# Altium schematic sheet MotorController.SchDoc
size A
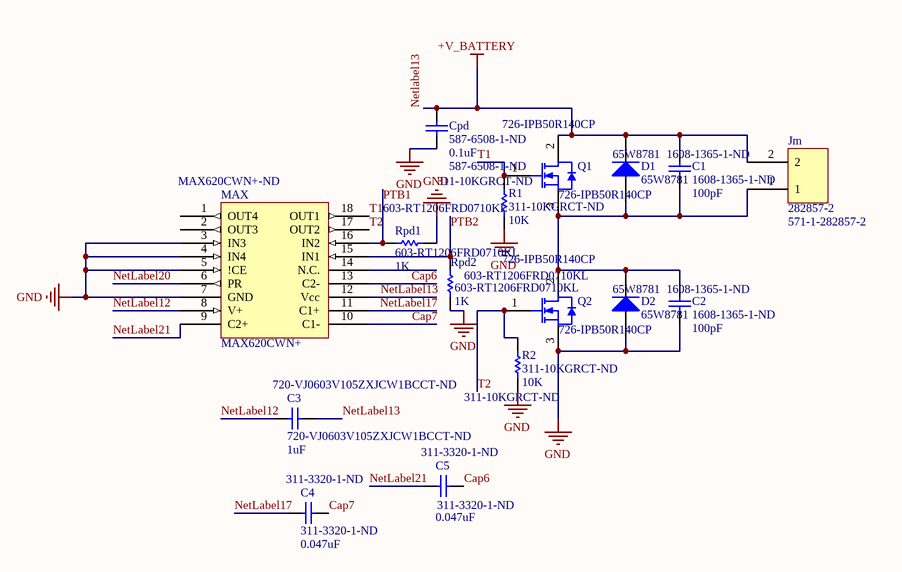
[diagram p0: MotorController.SchDoc]

## Parts
C1  1608-1365-1-ND  value 100pF  [1608[0603]]
C2  1608-1365-1-ND  value 100pF  [1608[0603]]
C3  720-VJ0603V105ZXJCW1BCCT-ND  value 1uF  [C1206]
C4  311-3320-1-ND  value 0.047uF  [C1206]
C5  311-3320-1-ND  value 0.047uF  [C1206]
Cpd  587-6508-1-ND  value 0.1uF  [C1206]
D1  65W8781  [SMC]
D2  65W8781  [SMC]
Jm  282857-2  Supplier Part Number 1: 571-1-282857-2  [282857-2]
MAX  MAX620CWN+  Supplier Part Number 2: MAX620CWN+-ND  [SOIC-SO18_L]
Q1  726-IPB50R140CP  [INF-PG-TO263-3-2_N]
Q2  726-IPB50R140CP  [INF-PG-TO263-3-2_N]
R1  311-10KGRCT-ND  value 10K  [C1206]
R2  311-10KGRCT-ND  value 10K  [C1206]
Rpd1  603-RT1206FRD0710KL  value 1K  [C1206]
Rpd2  603-RT1206FRD0710KL  value 1K  [C1206]

## Nets
GND: C2.1 Cpd.1 D2.1(A) MAX.3(IN3) MAX.4(IN4) MAX.5(!CE) MAX.7(GND) Q2.3(SOURCE) R1.1 R2.1 Rpd1.2 Rpd2.1
NetLabel13: C1.2 C3.2 Cpd.2 D1.2(K) Jm.2 MAX.12(Vcc) Q1.2(DRAIN)  [also labelled +V_BATTERY]
Cap6: C5.1 MAX.13(C2-)
Cap7: C4.2 MAX.10(C1-)
NetLabel12: C3.1 MAX.8(V+)
NetLabel17: C4.1 MAX.11(C1+)
NetLabel20: MAX.6(PR)
NetLabel21: C5.2 MAX.9(C2+)
PTB1: MAX.16(IN2) Rpd1.1
PTB2: MAX.15(IN1) Rpd2.2
T1: MAX.18(OUT1) Q1.1(GATE) R1.2
T2: MAX.17(OUT2) Q2.1(GATE) R2.2
NetC1_1: C1.1 C2.2 D1.1(A) D2.2(K) Jm.1 Q1.3(SOURCE) Q2.2(DRAIN)

Not connected (* = marked no-connect by the designer): MAX 1(OUT4) 2(OUT3) 14(N.C.)

## Library data of the parts
C1 C2 = Cap: Multilayer Ceramic Capacitors MLCC - SMD/SMT 0603 100pF 50V 5% Tol C0G, Digi-key; Manufacturer: Knowles Syfer; Manufacturer Part Number: 0603Y0500101JCT; Dissipation Factor: 0.1%; Capacitance: 50pF; Published: 8-Jun-2000; LatestRevisionDate: 17-Jul-2002; LatestRevisionNote: Re-released for DXP Platform.; PackageReference: RAD-0.3; Publisher: Altium Limited; PackageDescription: Radial Cap, Thru-Hole; 2 Leads; 0.3 in Pin Spacing; Supplier 1: Digi-Key; Supplier 2: Digi-Key; Supplier Part Number 2: 1608-1365-1-ND; RoHS: Yes; Category: Ceramic Capacitors; Stock 2: 32028; Pricing 2: 1=0.59000, 10=0.42000, 100=0.27650, 500=0.20480, 1000=0.17407 (USD); Case/Package: 0603; Case Code (Imperial): 0603; Case Code (Metric): 1608; Min Operating Temperature: -55°C; Max Operating Temperature: 125°C; Termination: SMD/SMT; Composition: Ceramic; Dielectric: C0G; Tolerance: 5%; Packaging: Tape and Reel; Package Quantity: 4000; Voltage Rating: 50V; Voltage Rating (DC): 50V; Length: 1.6mm; Depth: 0.8mm; ComponentLink1URL: https://datasheet.ciiva.com/5428/tandardmlccdatasheet-369797-5428107.pdf?src-supplier=Mouser; ComponentLink1Description: https://datasheet.ciiva.com/5428/tandardmlccdatasheet-369797-5428107.pdf?src-supplier=Mouser
C3 = Cap: Cap Ceramic 1uF 16V Y5V -20% to 80% SMD 0603 85C Paper T/R, Digi-key; Manufacturer: Vishay Vitramon; Dielectric Material: Tantalum; Published: 8-Jun-2000; LatestRevisionDate: 17-Jul-2002; LatestRevisionNote: Re-released for DXP Platform.; PackageReference: RAD-0.3; Publisher: Altium Limited; PackageDescription: Radial Cap, Thru-Hole; 2 Leads; 0.3 in Pin Spacing; Supplier 1: Digi-Key; Supplier Part Number 1: 720-VJ0603V105ZXJCW1BCCT-ND; Manufacturer Part Number: VJ0603V105ZXJCW1BC; RoHS: Yes; Category: Ceramic Capacitors; Stock 1: 4000; Pricing 1: 1=0.29000, 10=0.19600, 100=0.09910, 500=0.06784, 1000=0.06001 (USD); Mount: Surface Mount; Case/Package: 0603; Min Operating Temperature: -25°C; Max Operating Temperature: 85°C; Capacitance: 1uF; Tolerance: 80%; Dielectric: Y5V; Voltage Rating (DC): 16V; Length: 1.6mm; Depth: 0.8mm; Lead Free: Lead Free; ComponentLink1URL: https://datasheet.ciiva.com/11489/vjw1bcbascomseries-11489855.pdf?src-supplier=Avnet; ComponentLink1Description: https://datasheet.ciiva.com/11489/vjw1bcbascomseries-11489855.pdf?src-supplier=Avnet
C4 C5 = Cap: CAP CER 0.47UF 4V X5R 0201, Digi-key; Manufacturer: Yageo; Manufacturer Part Number: CC0201MRX5R4BB474; Capacitance: 470nF; Tolerance: 20%; Published: 8-Jun-2000; LatestRevisionDate: 17-Jul-2002; LatestRevisionNote: Re-released for DXP Platform.; PackageReference: RAD-0.3; Publisher: Altium Limited; PackageDescription: Radial Cap, Thru-Hole; 2 Leads; 0.3 in Pin Spacing; Supplier 1: Digi-Key; Supplier Part Number 1: 311-3320-1-ND; RoHS: Yes; Category: Ceramic Capacitors; Stock 1: 31395; Pricing 1: 1=0.10000, 10=0.07100, 100=0.03150, 500=0.02252, 1000=0.01770, 2500=0.01609, 5000=0.01480 (USD); Mount: Surface Mount; Case/Package: 0201; Min Operating Temperature: -55°C; Max Operating Temperature: 85°C; Packaging: Tape and Reel; Voltage Rating: 4V; Length: 0.024inch; Width: 0.012inch; Thickness: 0.013inch; ComponentLink1URL: http://www.yageo.com/documents/recent/UPY-GPHC_X5R_4V-to-50V_23.pdf?src-supplier=Digi-Key; ComponentLink1Description: http://www.yageo.com/documents/recent/UPY-GPHC_X5R_4V-to-50V_23.pdf?src-supplier=Digi-Key; ComponentLink2URL: http://www.yageo.com/documents/recent/UPY-GPHC_X5R_4V-to-50V_25.pdf?src-supplier=Digi-Key; ComponentLink2Description: http://www.yageo.com/documents/recent/UPY-GPHC_X5R_4V-to-50V_25.pdf?src-supplier=Digi-Key
Cpd = Cap: Multilayer Ceramic Capacitor 0.1uF 50V 10% 1206 Emboss T/R, Digikey; Manufacturer: Taiyo Yuden; Manufacturer Part Number: UMF316B7104KLHT; Published: 8-Jun-2000; LatestRevisionDate: 17-Jul-2002; LatestRevisionNote: Re-released for DXP Platform.; PackageReference: RAD-0.3; Publisher: Altium Limited; PackageDescription: Radial Cap, Thru-Hole; 2 Leads; 0.3 in Pin Spacing; Supplier 1: Digi-Key; Supplier Part Number 1: 587-6508-1-ND; RoHS: No; Stock 1: 3880; Pricing 1: 1=0.48000, 10=0.33200, 100=0.19920, 500=0.14942, 1000=0.12618 (USD)
D1 D2 = Diode: MULTICOMP - 1N4007 - DIODE, STANDARD, 1A, 1000V,DO-41, Newark; Forward Voltage: 1.1V; Max Repetitive Reverse Voltage (Vrrm): 1kV; Max Forward Surge Current (Ifsm): 30A; Element Configuration: Single; Published: 8-Jun-2000; LatestRevisionDate: 17-Jul-2002; LatestRevisionNote: Re-released for DXP Platform.; PackageVersion: Sep-1996; PackageReference: SMC; Publisher: Altium Limited; PackageDescription: DO-214-AB/SMC; 2 C-Bend Leads; Body 7.9 x 5.9 mm, inc. leads (LxW); Code_JEDEC: DO-214-AB; Supplier 1: Newark; Supplier 2: Newark; Supplier Part Number 2: 65W8781; Manufacturer: Multicomp; Manufacturer Part Number: 1N4007; RoHS: Yes; Category: Rectifier Diodes; Stock 2: 270000; Pricing 2: 1=0.02200, 5000=0.02200, 10000=0.02000, 15000=0.01700, 25000=0.01400, 50000=0.01200 (USD); Number of Pins: 2; Min Operating Temperature: -65°C; Max Operating Temperature: 150°C; Forward Current: 1A; REACH SVHC: No SVHC; ComponentLink1URL: https://datasheet.ciiva.com/1176/58590-1176850.pdf?src-supplier=Element14; ComponentLink1Description: https://datasheet.ciiva.com/1176/58590-1176850.pdf?src-supplier=Element14; ComponentLink2URL: https://datasheet.ciiva.com/1176/41320-1176847.pdf?src-supplier=Element14; ComponentLink2Description: https://datasheet.ciiva.com/1176/41320-1176847.pdf?src-supplier=Element14; ComponentLink3URL: https://datasheet.ciiva.com/1239/1505911-1239362.pdf?src-supplier=Newark; ComponentLink3Description: https://datasheet.ciiva.com/1239/1505911-1239362.pdf?src-supplier=Newark
MAX = MAX620CPN: MAXIM INTEGRATED PRODUCTS         MAX620CWN+             MOSFET Driver, 4.5V-16.5V supply, WSOIC-18, Digi-key; Max Supply Current: 500uA; Number of Outputs: 4; Max Supply Voltage: 16.5V; Min Supply Voltage: 4.5V; Max Output Current: 25mA; Max Power Dissipation: 762mW; Fall Time: 2500ns; Rise Time: 1700ns; Supplier 1: Digi-Key; Manufacturer: Maxim; Manufacturer Part Number: MAX620CWN+; RoHS: Yes; Category: Gate Drivers; Stock 2: 99; Pricing 2: 1=7.24000, 10=6.54000, 25=6.23600, 100=5.17140, 250=4.71512, 500=4.67708 (USD); Mount: Surface Mount; Case/Package: SOIC; Number of Pins: 18; Min Operating Temperature: 0°C; Max Operating Temperature: 70°C; Number of Drivers: 4; Nominal Supply Current: 500uA; Packaging: Rail/Tube; Package Quantity: 40; Radiation Hardening: No; Lead Free: Lead Free; REACH SVHC: Unknown; ComponentLink1URL: https://datasheet.ciiva.com/26879/max620cwn-26879943.pdf?src-supplier=IIIC; ComponentLink1Description: https://datasheet.ciiva.com/26879/max620cwn-26879943.pdf?src-supplier=IIIC
Q1 Q2 = CMP-1164-00461-1: N-Channel CoolMOS Power-Transistor, 500 V VDS, 23 A ID, -55 to 150 degC, PG-TO263-3-2, Reel, Green, Mouser; Manufacturer: Infineon; Polarity: N; VGS(th) (max): 3.5Â V; RthJC (max): 0.65Â K/W; VGS(th) (min): 2.5Â V; VDS (max): 500Â V; RthJA (max): 62Â K/W; IDpuls (max): 56Â A; RDS (on) (max): 140Â mOhm; Green: TRUE; ID (max): 23Â A; QG: 48Â nC; Ptot (max): 192Â W; ComponentLink1URL: http://www.infineon.com/; PackageDescription: 3-Pin Plastic (Green) Transistor Single Outline Package, 10 x 9.25 mm Body, 2.54 mm Pitch; ComponentLink3URL: http://www.infineon.com/dgdl/BTS141TC_DS_10.pdf?folderId=db3a3043163797a6011667aa084c0e01&fileId=db3a3043242ebc9e01242f43f58b003e&location=en.Products.Automotive_ICs.Smart_High-_and_Low-Side_Switches.HITFET___TEMPFET__-_Smart_Low-Side_Switches.DATASHEET.BT; Technology: CoolMOS CP; ComponentLink3Description: Package Specification; PackageVersion: Jul-09; Halogen-free: TRUE; ComponentLink2URL: http://www.infineon.com/dgdl/IPB50R140CP_rev2.0.pdf?folderId=db3a304412b407950112b408e8c90004&fileId=db3a304412b407950112b42d4eb4484f; Packing: Reel; DatasheetVersion: Rev. 2.0; ComponentLink2Description: Datasheet; ComponentLink1Description: Manufacturer URL; PartNumber: IPB50R140CP; PackageReference: PG-TO263-3-2; Mounting Technology: Surface Mount; Rth: 0.65Â K/W; Supplier 1: Mouser; Supplier Part Number 1: 726-IPB50R140CP
R1 R2 = Res1: Surface Mount Thick Film Resistor, RC Series, 10 kohm, 100 mW, - 5%, 50 V, 0603 [1608 Metric], Digi-key; Manufacturer: Yageo; Manufacturer Part Number: RC0603JR-0710KL; Temperature Coefficient: 100ppm/°C; Resistance: 10kR; Voltage Rating (DC): 50V; Max Power Dissipation: 100mW; Published: 8-Jun-2000; LatestRevisionDate: 17-Jul-2002; LatestRevisionNote: Re-released for DXP Platform.; PackageReference: AXIAL-0.3; Publisher: Altium Limited; PackageDescription: Axial Device, Thru-Hole; 2 Leads; 0.3 in Pin Spacing; Supplier 1: Digi-Key; Supplier Part Number 1: 311-10KGRCT-ND; RoHS: Yes; Category: Chip SMD Resistors; Stock 1: 2424073; Pricing 1: 1=0.10000, 10=0.01900, 100=0.00770, 1000=0.00347, 2500=0.00301 (USD); Case/Package: 0603; Number of Pins: 2; Contact Plating: Tin,Matte; Case Code (Imperial): 0603; Case Code (Metric): 1608; Min Operating Temperature: -55°C; Max Operating Temperature: 155°C; Composition: Thick Film; Tolerance: 5%; Packaging: Tape and Reel; Features: Moisture Resistant; Number of Terminations: 2; Termination: SMD/SMT; Military Standard: Not; Power Rating: 100mW; Voltage Rating: 50V; Length: 0.063inch; Width: 0.031inch; Height - Seated (Max): 0.022inch; Depth: 0.8mm; Radiation Hardening: No; Lead Free: Lead Free; REACH SVHC: Unknown; ComponentLink1URL: https://datasheet.ciiva.com/2452/pyu-rc-group-51-rohs-l-10-2452848.pdf?src-supplier=Digi-Key; ComponentLink1Description: https://datasheet.ciiva.com/2452/pyu-rc-group-51-rohs-l-10-2452848.pdf?src-supplier=Digi-Key
Rpd1 Rpd2 = Res1: RES SMD 10K OHM 1% 1/4W 1206, Mouser; Manufacturer: Yageo; Max Power Dissipation: 250mW; Temperature Coefficient: 25ppm/°C; Resistance: 10kR; Published: 8-Jun-2000; LatestRevisionDate: 17-Jul-2002; LatestRevisionNote: Re-released for DXP Platform.; PackageReference: AXIAL-0.3; Publisher: Altium Limited; PackageDescription: Axial Device, Thru-Hole; 2 Leads; 0.3 in Pin Spacing; Supplier 1: Mouser; Supplier Part Number 1: 603-RT1206FRD0710KL; Manufacturer Part Number: RT1206FRD0710KL; RoHS: Yes; Category: Chip SMD Resistors; Stock 1: 8660; Pricing 1: 1=0.15000, 10=0.09100, 100=0.03000, 1000=0.02100, 5000=0.01600, 10000=0.01500 (USD); Case/Package: 1206; Min Operating Temperature: -55°C; Max Operating Temperature: 155°C; Tolerance: 1%; Packaging: Tape and Reel; Features: Moisture Resistant; Composition: Thin Film; Number of Terminations: 2; Length: 0.122inch; Height: 0.026inch; Width: 0.063inch; ComponentLink1URL: http://www.yageo.com/documents/recent/PYu-RT_1-to-0.01_RoHS_L_8.pdf?src-supplier=Digi-Key; ComponentLink1Description: http://www.yageo.com/documents/recent/PYu-RT_1-to-0.01_RoHS_L_8.pdf?src-supplier=Digi-Key
Jm = 282857-2: Supplier 1: Mouser